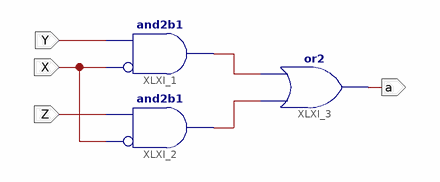
[diagram p0: schematic sheet 1]
// Xilinx ISE schematic circuitoA.sch (spartan3e) as structural Verilog: 3 symbols, 4 ports
module circuitoA (
  input  Y,
  input  X,
  input  Z,
  output a
);

  wire XLXN_1, XLXN_2;

  and XLXI_1 (XLXN_1, ~X, Y);  // and2b1
  and XLXI_2 (XLXN_2, ~X, Z);  // and2b1
  or XLXI_3 (a, XLXN_2, XLXN_1);
endmodule
